# Altium schematic sheet [09] - ETHERNET.SchDoc: ETHERNET
size A3; Organization: Bjørn T. Brodtkorb; Address1: Frode Rinnans veg 161; Address2: 7050 Trondheim; DocumentNumber: 6598; Revision: 1.0; SheetNumber: 1; SheetTotal: 1
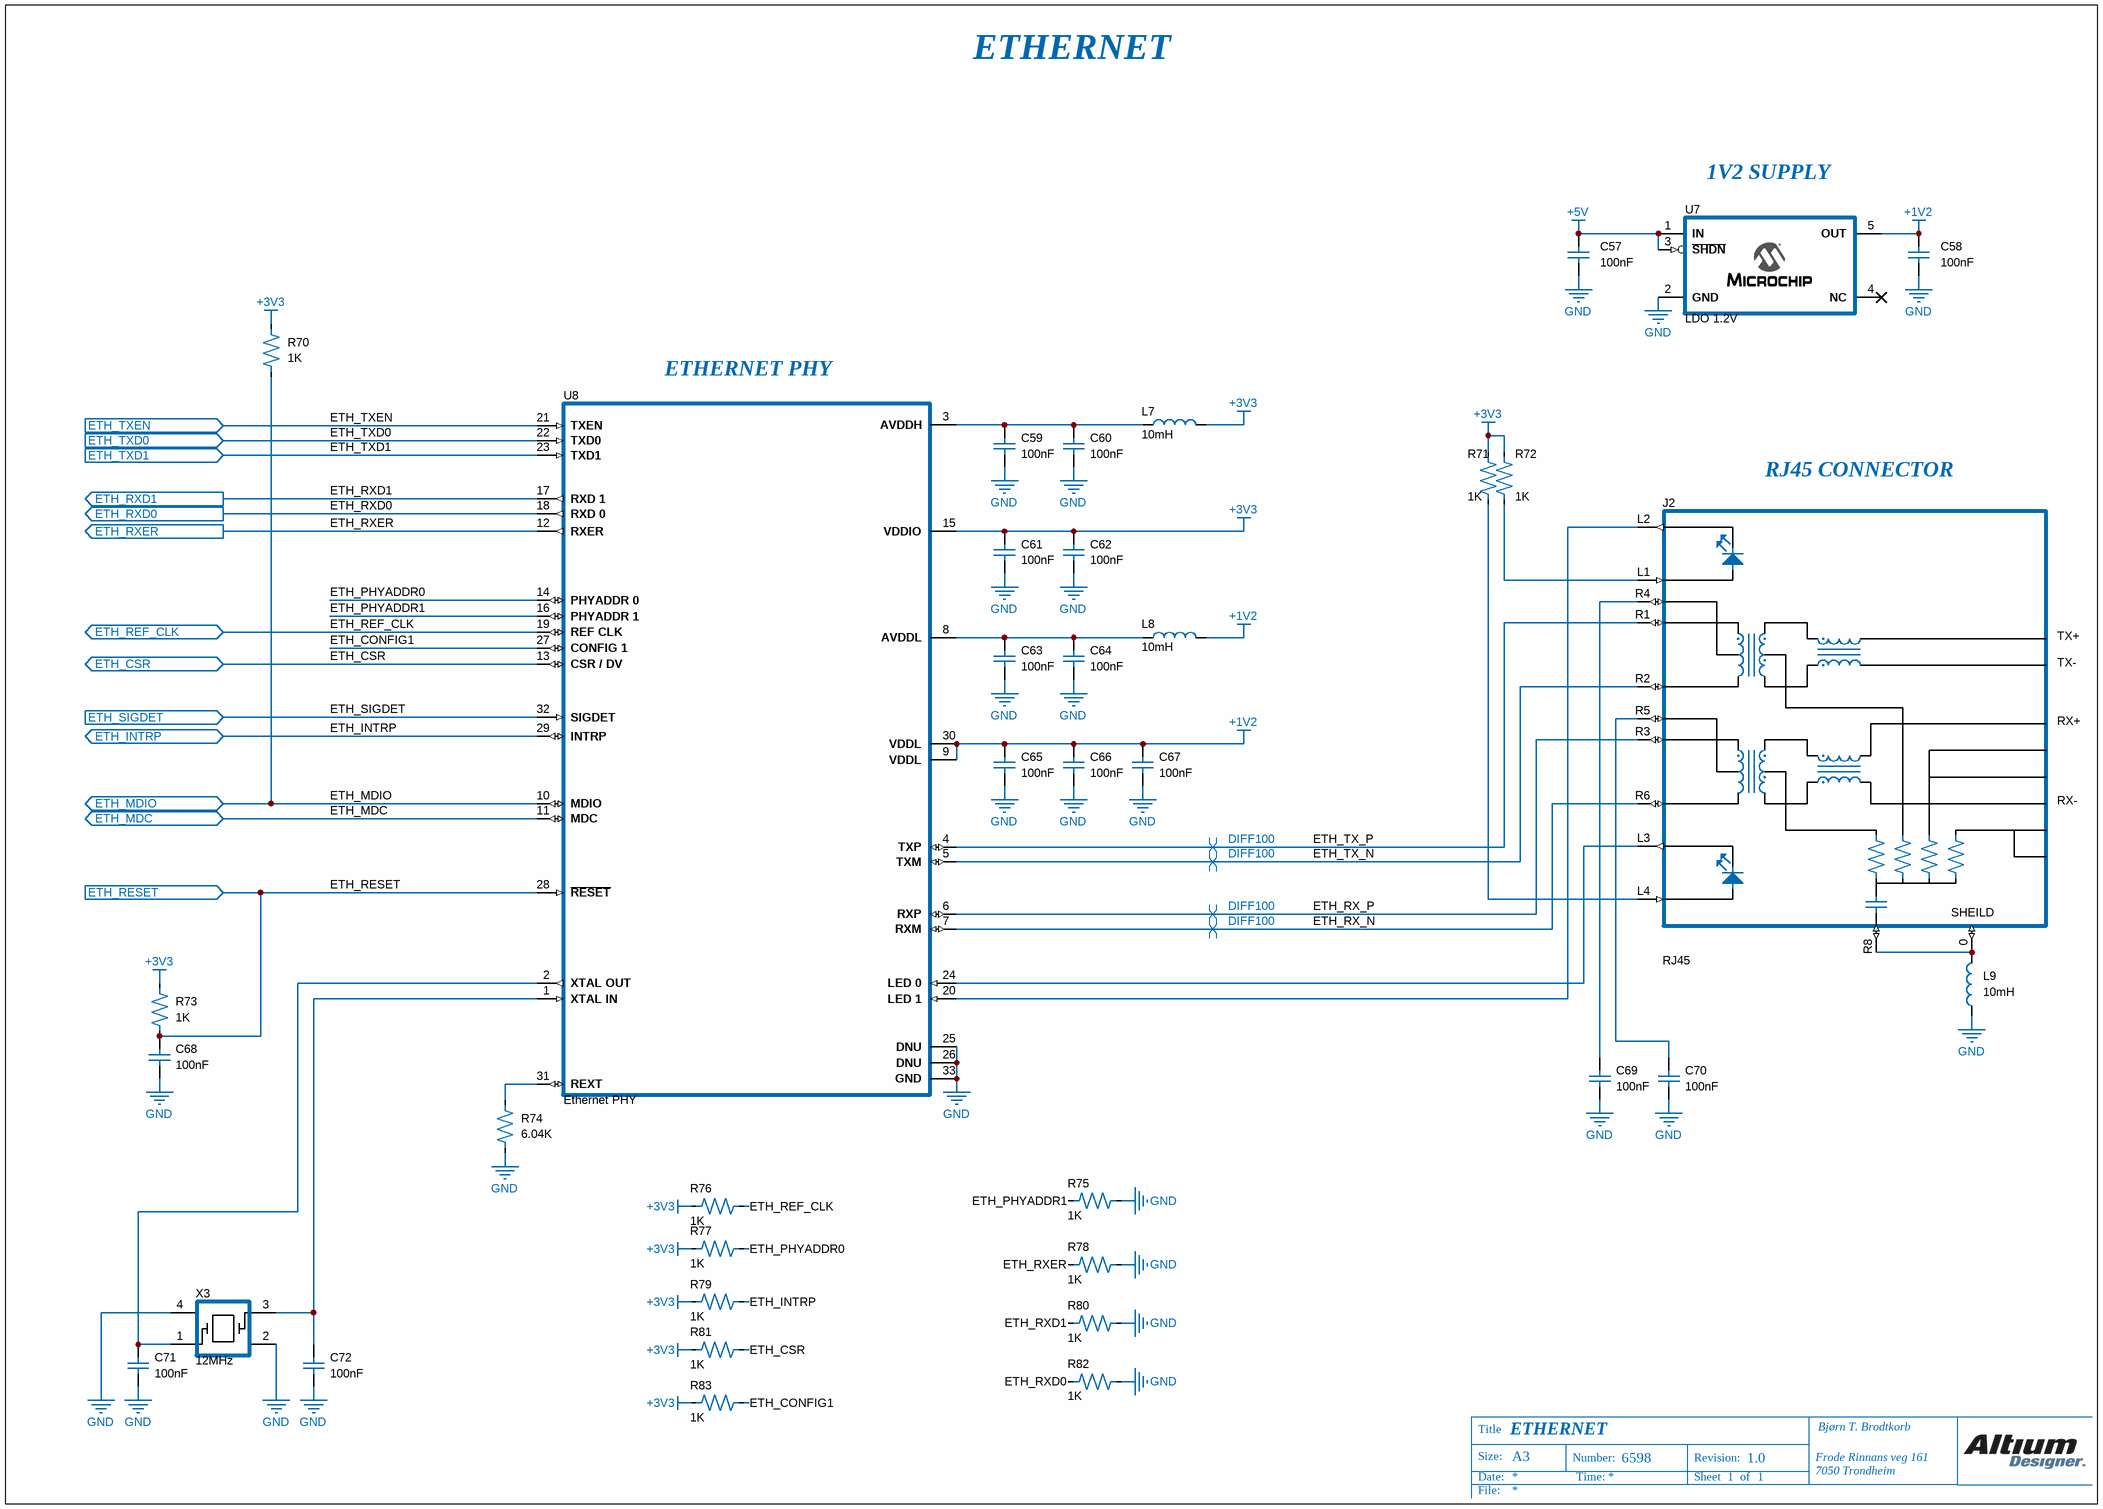
[diagram p0: [09] - ETHERNET.SchDoc]

## Parts
C57  value 100nF  [C0805]  (hidden comment: 08053C105KAT2A)
C58  value 100nF  [C0805]  (hidden comment: 08053C105KAT2A)
C59  value 100nF  [C0402]  (hidden comment: 04023C103KAT2A)
C60  value 100nF  [C0603]  (hidden comment: 02016D104KAT2A)
C61  value 100nF  [C0402]  (hidden comment: 04023C103KAT2A)
C62  value 100nF  [C0603]  (hidden comment: 02016D104KAT2A)
C63  value 100nF  [C0402]  (hidden comment: 04023C103KAT2A)
C64  value 100nF  [C0603]  (hidden comment: 02016D104KAT2A)
C65  value 100nF  [C0402]  (hidden comment: 04023C103KAT2A)
C66  value 100nF  [C0402]  (hidden comment: 04023C103KAT2A)
C67  value 100nF  [C0603]  (hidden comment: 02016D104KAT2A)
C68  value 100nF  [C0402]  (hidden comment: 04023C103KAT2A)
C69  value 100nF  [C0402]  (hidden comment: 04023C103KAT2A)
C70  value 100nF  [C0402]  (hidden comment: 04023C103KAT2A)
C71  value 100nF  [C0402]  (hidden comment: 04023C103KAT2A)
C72  value 100nF  [C0402]  (hidden comment: 04023C103KAT2A)
J2  RJ45  [RJ45 8P8C LED & magnetics]
L7  value 10mH  [Inductor 0603]  (hidden comment: MLZ1608A2R2WT)
L8  value 10mH  [Inductor 0603]  (hidden comment: MLZ1608A2R2WT)
L9  value 10mH  [Inductor 0603]  (hidden comment: MLZ1608A2R2WT)
R70  value 1K  [R0402]  (hidden comment: CRCW04020000Z0ED)
R71  value 1K  [R0402]  (hidden comment: CRCW04020000Z0ED)
R72  value 1K  [R0402]  (hidden comment: CRCW04020000Z0ED)
R73  value 1K  [R0402]  (hidden comment: CRCW04020000Z0ED)
R74  value 6.04K  [R0402]  (hidden comment: CRCW04020000Z0ED)
R75  value 1K  [R0402]  (hidden comment: CRCW04020000Z0ED)
R76  value 1K  [R0402]  (hidden comment: CRCW04020000Z0ED)
R77  value 1K  [R0402]  (hidden comment: CRCW04020000Z0ED)
R78  value 1K  [R0402]  (hidden comment: CRCW04020000Z0ED)
R79  value 1K  [R0402]  (hidden comment: CRCW04020000Z0ED)
R80  value 1K  [R0402]  (hidden comment: CRCW04020000Z0ED)
R81  value 1K  [R0402]  (hidden comment: CRCW04020000Z0ED)
R82  value 1K  [R0402]  (hidden comment: CRCW04020000Z0ED)
R83  value 1K  [R0402]  (hidden comment: CRCW04020000Z0ED)
U7  LDO 1.2V  [MCP1801T-1202I/OT]
U8  Ethernet PHY  [KSZ8061RNBW]
X3  12MHz  [MCSJK-7U-12.00-12-30-80-B-30]

## Ports
ETH_CSR (bidir), ETH_INTRP (bidir), ETH_MDC (bidir), ETH_MDIO (bidir), ETH_REF_CLK (bidir), ETH_RESET (in), ETH_RXD0 (out), ETH_RXD1 (out), ETH_RXER (out), ETH_SIGDET (in), ETH_TXD0 (in), ETH_TXD1 (in), ETH_TXEN (in)

## Nets
+1V2: C58.2 C65.2 C66.2 C67.1 L8.2 U7.5(OUT) U8.9(VDDL) U8.30(VDDL)
+3V3: C61.2 C62.1 L7.2 R70.1 R71.1 R72.1 R73.1 R76.1 R77.1 R79.1 R81.1 R83.1 U8.15(VDDIO)
+5V: C57.2 U7.1(IN) U7.3(~{SHDN})
GND: C57.1 C58.1 C59.1 C60.2 C61.1 C62.2 C63.1 C64.2 C65.1 C66.1 C67.2 C68.1 C69.1 C70.1 C71.1 C72.1 L9.1 R74.2 R75.2 R78.2 R80.2 R82.2 U7.2(GND) U8.25(DNU) U8.26(DNU) U8.33(GND) X3.2 X3.4
ETH_CONFIG1: R83.2 U8.27(CONFIG_1)
ETH_CSR: R81.2 U8.13(CSR_/_DV) ; port ETH_CSR
ETH_INTRP: R79.2 U8.29(INTRP) ; port ETH_INTRP
ETH_MDC: U8.11(MDC) ; port ETH_MDC
ETH_MDIO: R70.2 U8.10(MDIO) ; port ETH_MDIO
ETH_PHYADDR0: R77.2 U8.14(PHYADDR_0)
ETH_PHYADDR1: R75.1 U8.16(PHYADDR_1)
ETH_REF_CLK: R76.2 U8.19(REF_CLK) ; port ETH_REF_CLK
ETH_RESET: C68.2 R73.2 U8.28(~{RESET}) ; port ETH_RESET
ETH_RX_N: J2.R6 U8.7(RXM)
ETH_RX_P: J2.R3 U8.6(RXP)
ETH_RXD0: R82.1 U8.18(RXD_0) ; port ETH_RXD0
ETH_RXD1: R80.1 U8.17(RXD_1) ; port ETH_RXD1
ETH_RXER: R78.1 U8.12(RXER) ; port ETH_RXER
ETH_SIGDET: U8.32(SIGDET) ; port ETH_SIGDET
ETH_TX_N: J2.R2 U8.5(TXM)
ETH_TX_P: J2.R1 U8.4(TXP)
ETH_TXD0: U8.22(TXD0) ; port ETH_TXD0
ETH_TXD1: U8.23(TXD1) ; port ETH_TXD1
ETH_TXEN: U8.21(TXEN) ; port ETH_TXEN
NetC59_2: C59.2 C60.1 L7.1 U8.3(AVDDH)
NetC63_2: C63.2 C64.1 L8.1 U8.8(AVDDL)
NetC69_2: C69.2 J2.R4
NetC70_2: C70.2 J2.R5
NetC71_2: C71.2 U8.2(XTAL_OUT) X3.1
NetC72_2: C72.2 U8.1(XTAL_IN) X3.3
NetJ2_0: J2.0 J2.R8 L9.2
NetJ2_L1: J2.L1 R72.2
NetJ2_L2: J2.L2 U8.20(LED_1)
NetJ2_L3: J2.L3 U8.24(LED_0)
NetJ2_L4: J2.L4 R71.2
NetR74_1: R74.1 U8.31(REXT)

Not connected (* = marked no-connect by the designer): J2 1 2; U7 4(NC)*

## Layout directives
differential pair; differential pair class DIFF100: ETH_RX_N, ETH_RX_P, ETH_TX_N, ETH_TX_P

## Notes on the sheet
- ETHERNET
- (near U7) 1V2 SUPPLY
- (near U8) ETHERNET PHY
- (near J2) RJ45 CONNECTOR
- Title
- Size:
- A3
- Number:
- Revision:
- Date:
- File:
- Time:
- Sheet
- of
- (in symbol 234235-2-2-1-12) TX+; TX-; RX+; RX-; SHEILD

## Library data of the parts
C57 C58 = 08053C105KAT2A: C0805
C59 C61 C63 C65 C66 C68-C72 = 04023C103KAT2A: C0402
C60 C62 C64 C67 = 02016D104KAT2A: C0603
J2 = 234235-2-2-1-12: RJ45 8P8C LED & magnetics; Supplier 1: Digi-Key; Supplier Part Number 1: RJMG1BD3B8K1ANR-ND
L7-L9 = MLZ1608A2R2WT: Inductor 0603
R70-R83 = CRCW04020000Z0ED: R0402
U7 = MCP1801T-1202I/OT: LDO fixed 1.2V 150mA; Dropout voltage: 1.03V; Supplier 1: Farnell; Supplier Part Number 1: 1851980; Output current: 150mA; Output voltage: 1.2V
U8 = KSZ8061RNBW: Ethernet PHY 10BASE-T / 100BASE-T; Supplier 1: Digi-Key; Supplier Part Number 1: KSZ8061RNBW-CT-ND
X3 = MCSJK-7U-12.00-12-30-80-B-30: Crystal 12MHz 3.2mm x 2.5mm; Supplier Part Number 1: 2853917; Supplier 1: Farnell